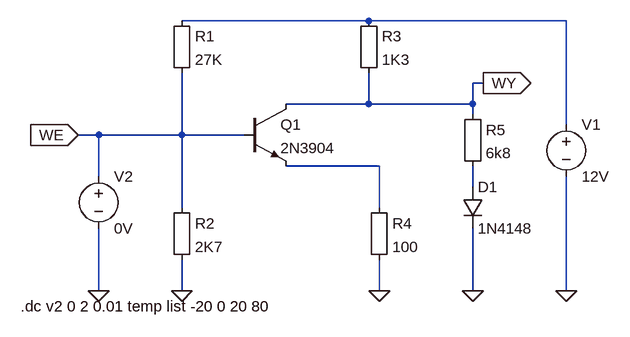
[diagram p0: schematic v3.asc]
v3.asc, the LTspice schematic file:
Version 4.1
SHEET 1 1256 680
WIRE 464 32 176 32
WIRE 768 32 464 32
WIRE 640 128 624 128
WIRE 464 160 464 112
WIRE 464 160 336 160
WIRE 624 160 624 128
WIRE 624 160 464 160
WIRE 624 176 624 160
WIRE 768 192 768 32
WIRE 48 208 16 208
WIRE 176 208 176 112
WIRE 176 208 48 208
WIRE 272 208 176 208
WIRE 480 256 336 256
WIRE 48 272 48 208
WIRE 624 288 624 256
WIRE 176 320 176 208
WIRE 480 320 480 256
WIRE 48 448 48 352
WIRE 176 448 176 400
WIRE 480 448 480 400
WIRE 624 448 624 352
WIRE 768 448 768 272
FLAG 176 448 0
FLAG 480 448 0
FLAG 768 448 0
FLAG 16 208 WE
IOPIN 16 208 In
FLAG 640 128 WY
IOPIN 640 128 Out
FLAG 624 448 0
FLAG 48 448 0
DATAFLAG 256 208 "$-V(N002)"
DATAFLAG 480 160 "$-V(N002)"
SYMBOL npn 272 160 R0
SYMATTR InstName Q1
SYMATTR Value 2N3904
SYMBOL Misc\\EuropeanResistor 160 16 R0
SYMATTR InstName R1
SYMATTR Value 27K
SYMBOL Misc\\EuropeanResistor 160 304 R0
SYMATTR InstName R2
SYMATTR Value 2K7
SYMBOL Misc\\EuropeanResistor 448 16 R0
SYMATTR InstName R3
SYMATTR Value 1K3
SYMBOL Misc\\EuropeanResistor 464 304 R0
SYMATTR InstName R4
SYMATTR Value 100
SYMBOL voltage 768 176 R0
WINDOW 123 0 0 Left 0
WINDOW 39 0 0 Left 0
SYMATTR InstName V1
SYMATTR Value 12V
SYMBOL Misc\\EuropeanResistor 608 160 R0
SYMATTR InstName R5
SYMATTR Value 6k8
SYMBOL diode 608 288 R0
SYMATTR InstName D1
SYMATTR Value 1N4148
SYMBOL voltage 48 256 R0
WINDOW 123 0 0 Left 0
WINDOW 39 0 0 Left 0
SYMATTR InstName V2
SYMATTR Value 0V
TEXT -72 472 Left 2 !.dc v2 0 2 0.01 temp list -20 0 20 80

The netlist it stands for:
* v3.asc
Q1 WY WE N002 0 2N3904
R1 N001 WE 27K
R2 WE 0 2K7
R3 N001 WY 1K3
R4 N002 0 100
V1 N001 0 12V
R5 WY N003 6k8
D1 N003 0 1N4148
V2 WE 0 0V
.model D D
.lib standard.dio
.model NPN NPN
.model PNP PNP
.lib standard.bjt
.dc v2 0 2 0.01 temp list -20 0 20 80
.backanno
.end